# Altium schematic sheet Mechanical.SchDoc: Mechanical
size A4; Date: Not used; ApprovedBy: Not used; CheckedBy: Not used; Author: Not used; CompanyName: STMicroelectronics; DrawnBy: Not used; Engineer: Not used; Organization: Not used; Address1: Not used; Address2: Not used; Address3: Not used; Address4: Not used; DocumentNumber: 8; Revision: Not used; SheetNumber: 8; SheetTotal: 8; CurrentTime: Not used; CurrentDate: Not used; Time: Not used; DocumentFullPathAndName: Not used; DocumentName: Not used; ModifiedDate: Not used; ImagePath: Not used; ProjectName: Not used; Application_BuildNumber: Not used
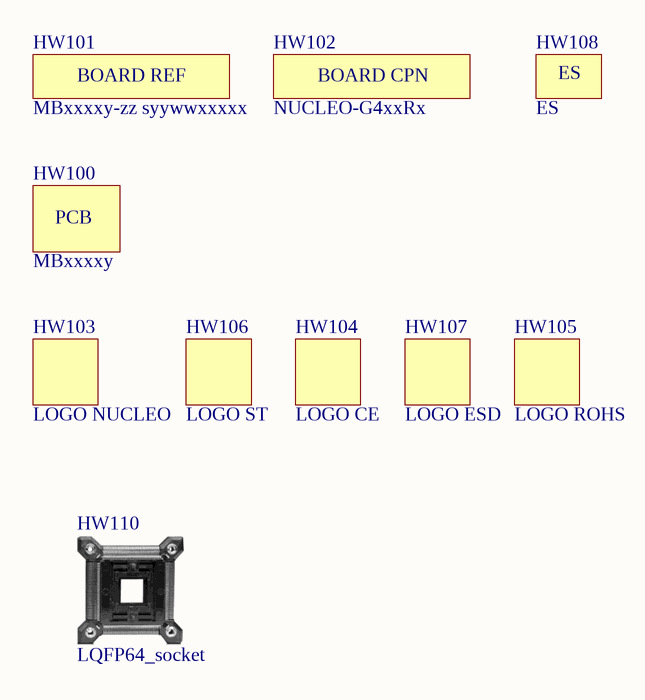
[diagram p0: Mechanical.SchDoc]

## Parts
HW100  value MBxxxxy  (mechanical)
HW101  value MBxxxxy-zz syywwxxxxx  [STICKER_25X9]  (mechanical)
HW102  value NUCLEO-G4xxRx  (mechanical)
HW103  value LOGO NUCLEO  [LOGO_NUCLEO]  (no BOM)
HW104  value LOGO CE  [LOGO_CE]  (no BOM)
HW105  value LOGO ROHS  [LOGO_ROHS]  (no BOM)
HW106  value LOGO ST  [LOGO_ST]  (no BOM)
HW107  value LOGO ESD  [LOGO_MAIN_1]  (no BOM)
HW108  value ES  (mechanical)
HW110  value LQFP64_socket  (hidden comment: SOCKET_LQFP64)  (mechanical)

## Notes on the sheet
- Title:
- Project:
- Size:
- Revision:
- Variant:
- A4
- -
- Date:
- Reference:
- Sheet:
- of
- (in symbol MCD-00235) BOARD REF
- (in symbol MCD-00549) BOARD CPN

## Library data of the parts
HW100 = MCD-00216: PCB, xxxx for PCB number, Y for PCB revision; Part_Type: Mechanical; Provided_By: SUBCO; Internal_Part_Number: MCD-00216; Status: Released; ECCN_US: n/a; ECCN_EU: n/a; Manufacturer_Part_Number: n/a; Manufacturer: n/a; ComponentLink1Description: Datasheet
HW101 = MCD-00235: Sticker to mention board reference + serial number; Part_Type: Mechanical; Provided_By: SUBCO; Internal_Part_Number: MCD-00235; ECCN_US: n/a; ECCN_EU: n/a; Status: Released; Manufacturer_Part_Number: n/a; Manufacturer: n/a; ComponentLink1Description: Datasheet; ComponentLink1URL: n/a
HW102 = MCD-00549: Product sticker to mention product CPN + product FG; Part_Type: Mechanical; Provided_By: Subcon; Initial_Board_Reference: MB1319; Internal_Part_Number: MCD-00549; ECCN_US: n/a; ECCN_EU: n/a; Status: Released
HW103 = MCD-00636: NUCLEO logo footprint for PCB; Part_Type: Mechanical; Manufacturer_Part_Number: NONE; Internal_Part_Number: MCD-00636; Status: Obsolete; ECCN_US: n/a; ECCN_EU: n/a; Provided_By: n/a; Manufacturer: NONE; ComponentLink1Description: Datasheet
HW104 = MCD-00626: CE logo footprint for PCB; Part_Type: Mechanical; Manufacturer_Part_Number: NONE; Internal_Part_Number: MCD-00626; Status: Obsolete; ECCN_US: n/a; ECCN_EU: n/a; Provided_By: n/a; Manufacturer: NONE; ComponentLink1Description: Datasheet
HW105 = MCD-00628: ROHS logo footprint for PCB; Part_Type: Mechanical; Manufacturer_Part_Number: NONE; Internal_Part_Number: MCD-00628; Status: Obsolete; ECCN_US: n/a; ECCN_EU: n/a; Provided_By: n/a; Manufacturer: NONE; ComponentLink1Description: Datasheet
HW106 = MCD-00625: STMicroelectronics logo footprint for PCB; Part_Type: Mechanical; Manufacturer_Part_Number: NONE; Internal_Part_Number: MCD-00625; Status: Obsolete; ECCN_US: n/a; ECCN_EU: n/a; Provided_By: n/a; Manufacturer: NONE; ComponentLink1Description: Datasheet; ComponentLink1URL: http://na
HW107 = MCD-00627: Hand ESD logo footprint for PCB; Part_Type: Mechanical; Manufacturer_Part_Number: NONE; Internal_Part_Number: MCD-00627; Status: Obsolete; ECCN_US: n/a; ECCN_EU: n/a; Provided_By: n/a; Manufacturer: NONE; ComponentLink1Description: Datasheet; ComponentLink1URL: http://na
HW108 = MCD-00234: Sticker to mention ES sample; Part_Type: Mechanical; Provided_By: SUBCO; Internal_Part_Number: MCD-00234; Status: Released; ECCN_US: n/a; ECCN_EU: n/a; Manufacturer_Part_Number: n/a; Manufacturer: n/a; ComponentLink1Description: Datasheet
HW110 = MCD-01253: Yamaichi socket for LQFP64, with positioning pins.; Part_Type: Misc; Manufacturer_Part_Number: IC149-064-169-B5; Provided_By: SUBCO; Internal_Part_Number: MCD-01253; Status: Checked; Manufacturer: YAMAICHI; ComponentLink1Description: Datasheet; ComponentLink1URL: http://tunmcdsvn.tun.st.com/Component_Datasheet_Library/Trunk/Misc/Yamaichi_LQFP_socket_IC149_64p_10x10_12789; ECCN_US: n/a; ECCN_EU: n/a